# Altium schematic sheet PIC32MX.SchDoc
size A1
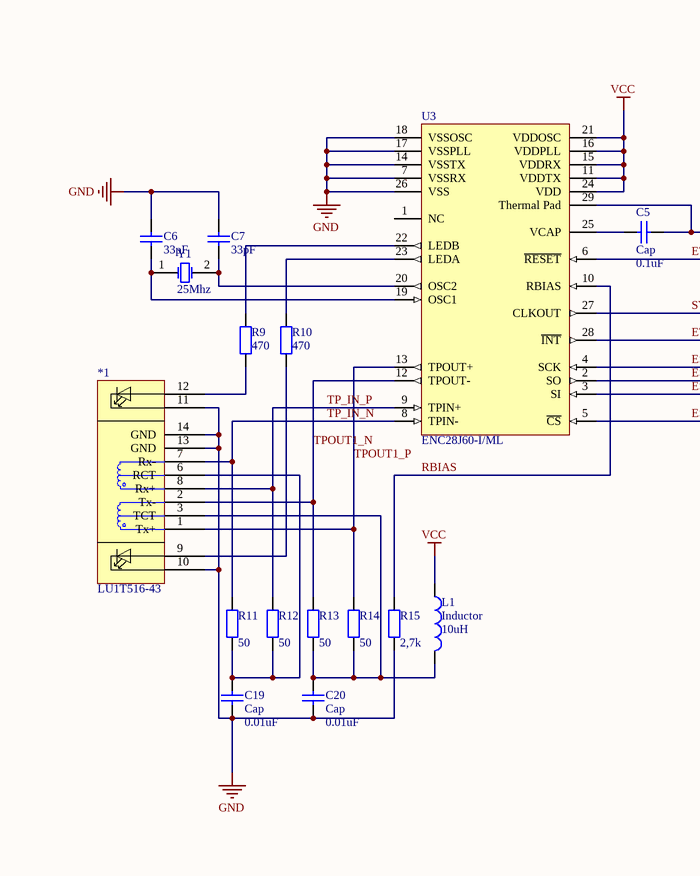
[diagram p0: PIC32MX.SchDoc, top left]
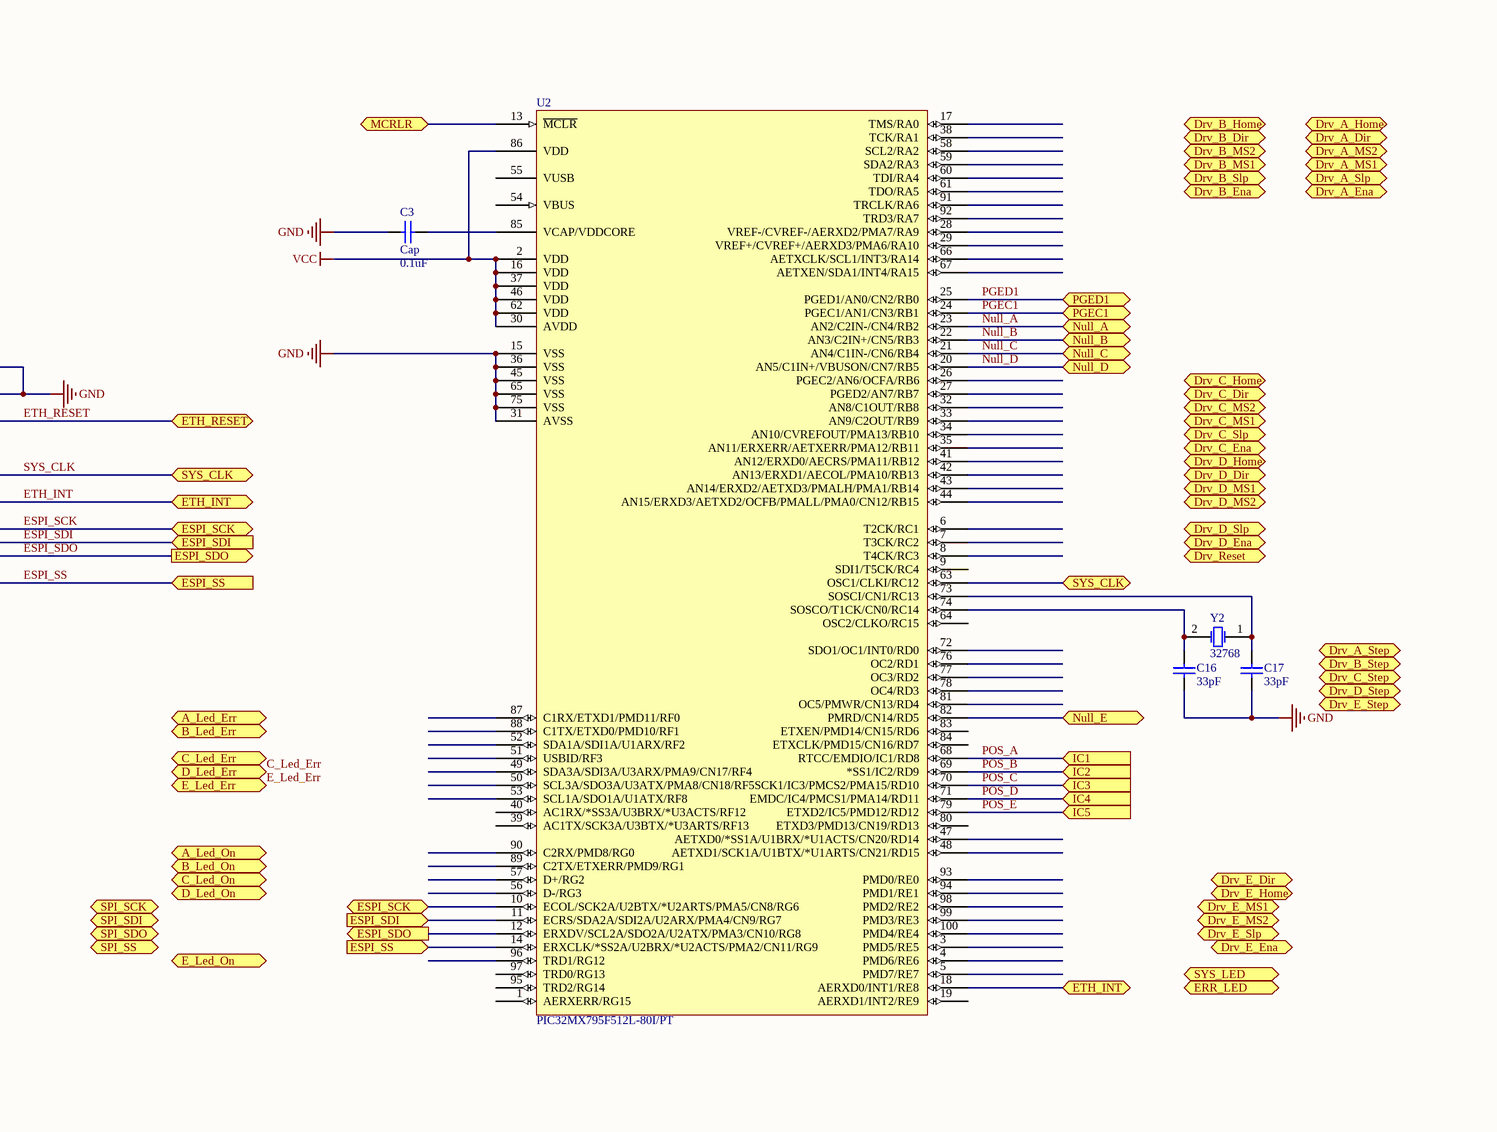
[diagram p1: PIC32MX.SchDoc, top middle]
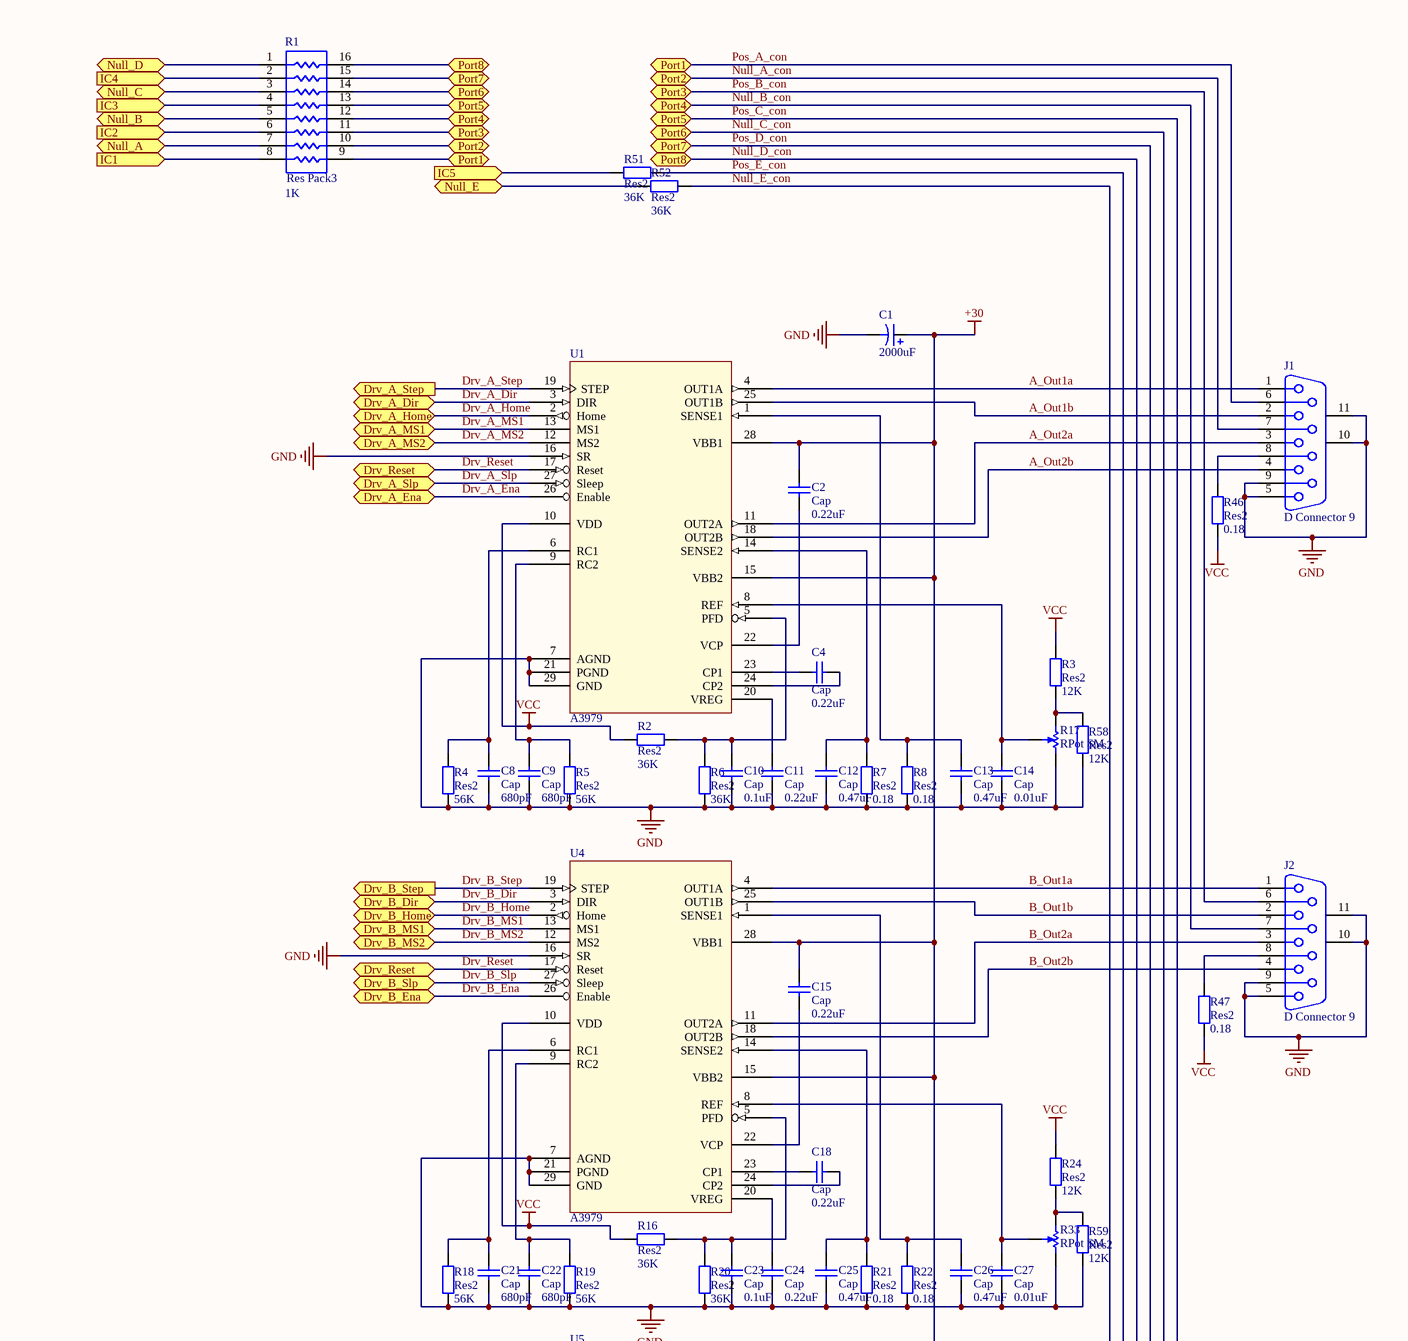
[diagram p2: PIC32MX.SchDoc, top right]
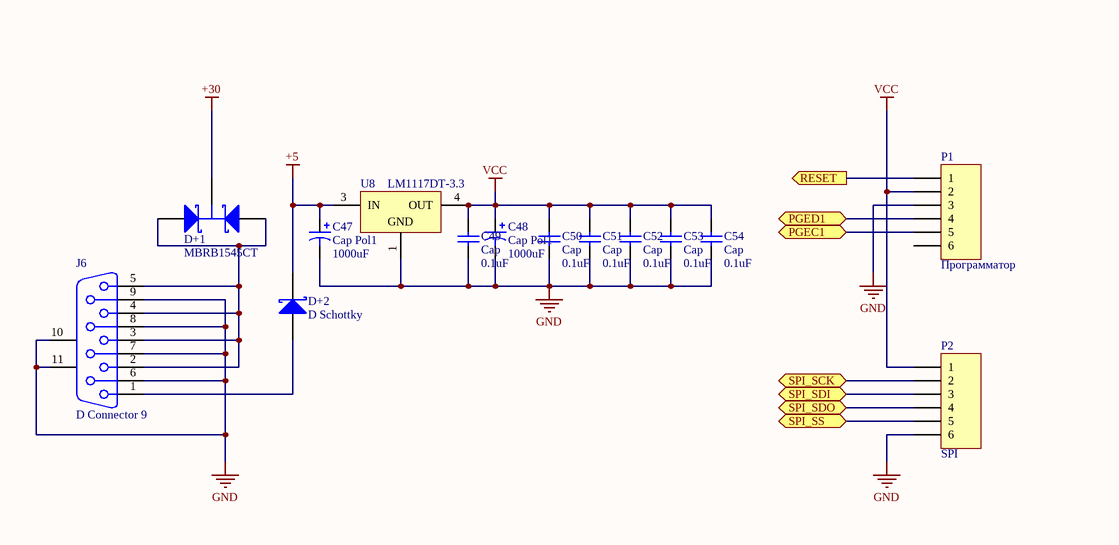
[diagram p3: PIC32MX.SchDoc, bottom left]
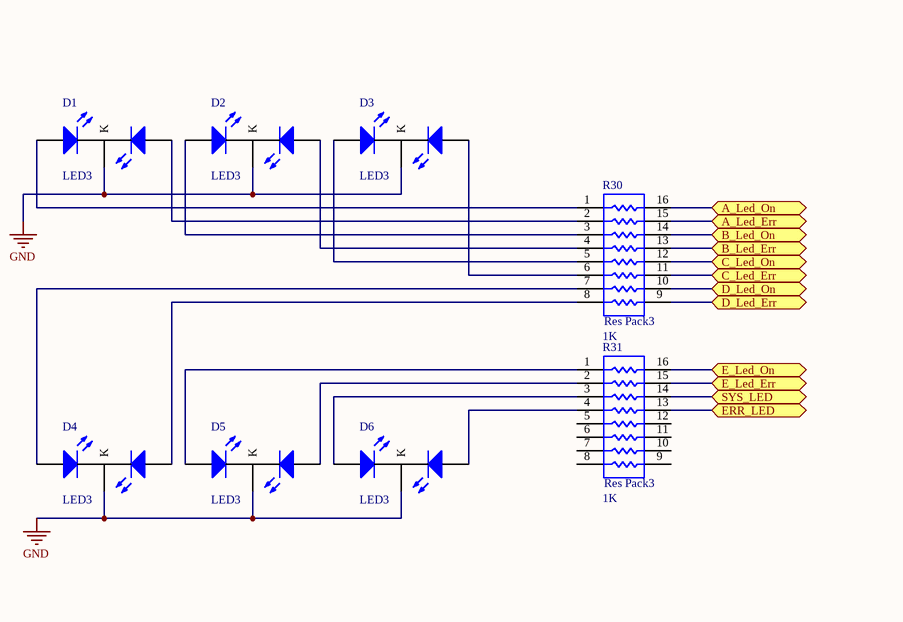
[diagram p4: PIC32MX.SchDoc, bottom middle]
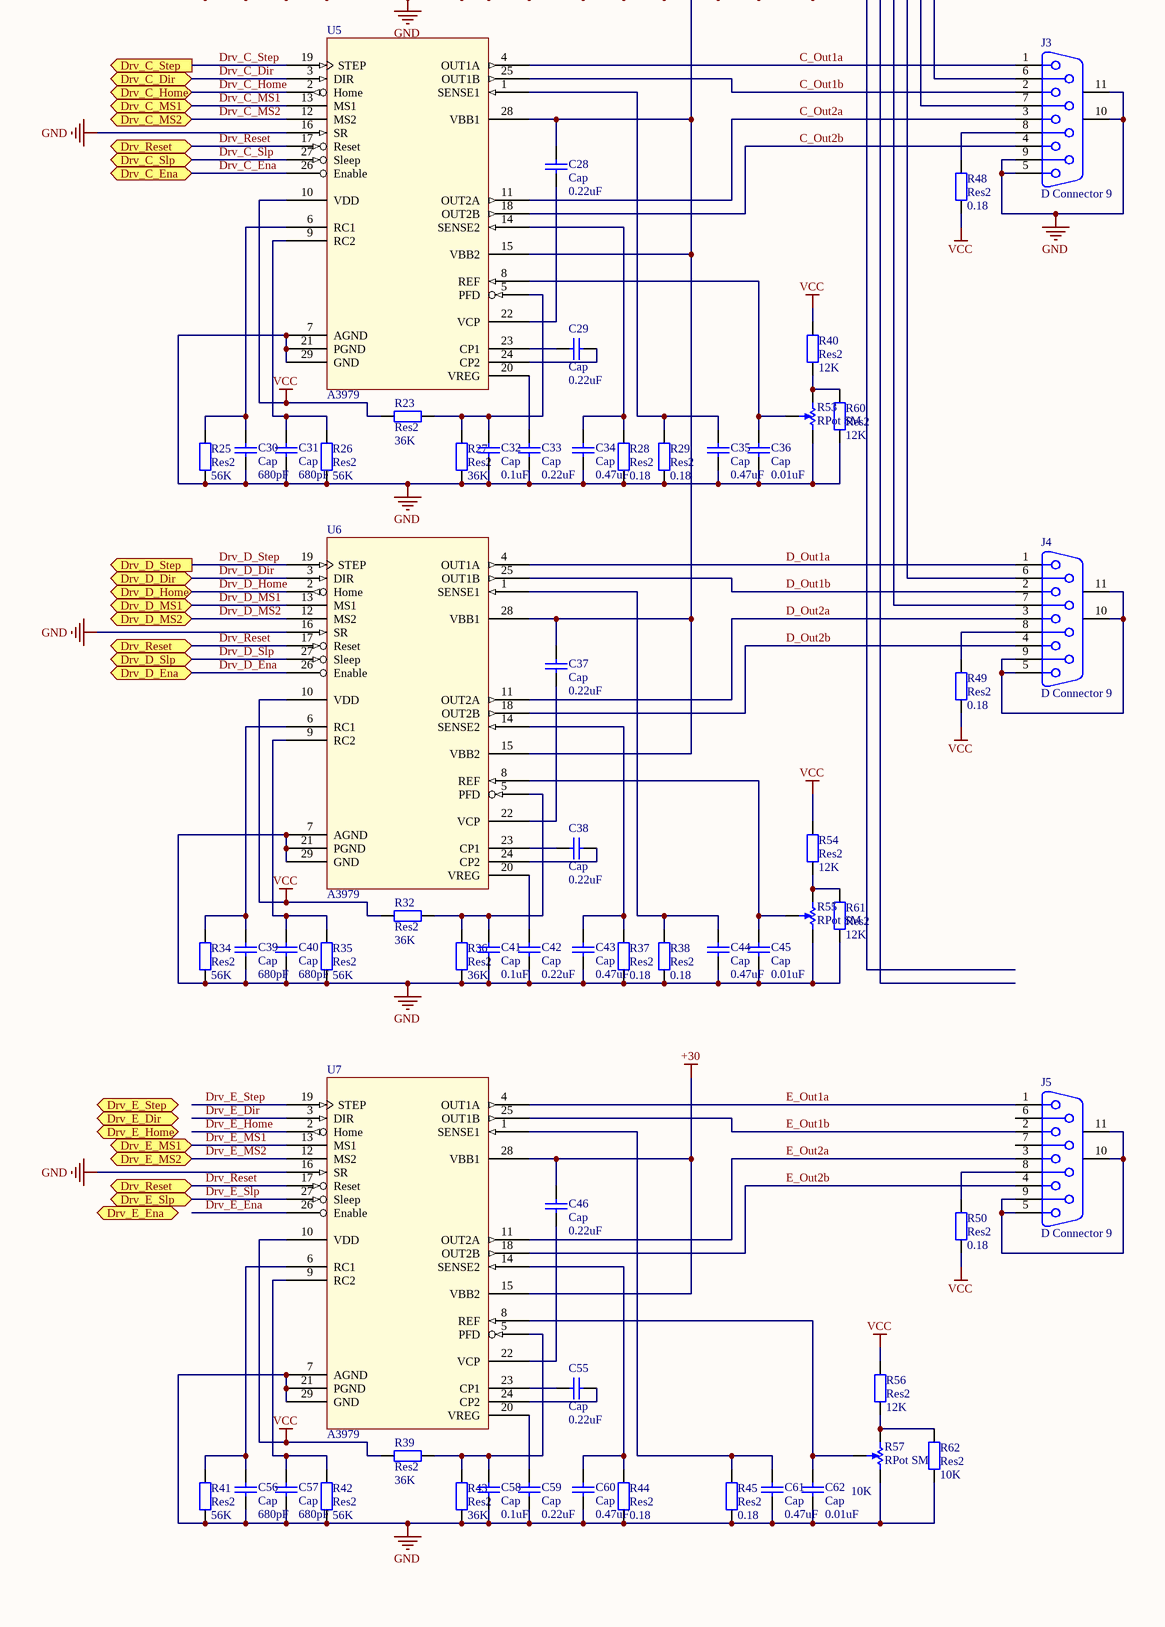
[diagram p5: PIC32MX.SchDoc, bottom right]

## Parts
*1  LU1T516-43  [EthernetCON]
C1  value 2000uF  [CAPPR7.5-16x35]  (hidden comment: Cap Pol1)
C2  Cap  value 0.22uF  [CAPC3225L]
C3  Cap  value 0.1uF  [CAPC3225L]
C4  Cap  value 0.22uF  [CapC3225L]
C5  Cap  value 0.1uF  [CAPC3225L]
C6  value 33pF  [CAPC2012L]  (hidden comment: Cap)
C7  value 33pF  [CAPC2012L]  (hidden comment: Cap)
C8  Cap  value 680pF  [CAPC2012L]
C9  Cap  value 680pF  [CAPC2012L]
C10  Cap  value 0.1uF  [CAPC3225L]
C11  Cap  value 0.22uF  [CAPC3225L]
C12  Cap  value 0.47uF  [CAPC3225L]
C13  Cap  value 0.47uF  [CAPC3225L]
C14  Cap  value 0.01uF  [CAPC2012L]
C15  Cap  value 0.22uF  [CAPC3225L]
C16  value 33pF  [CAPC2012L]  (hidden comment: Cap)
C17  value 33pF  [CAPC2012L]  (hidden comment: Cap)
C18  Cap  value 0.22uF  [CapC3225L]
C19  Cap  value 0.01uF  [CAPC3225L]
C20  Cap  value 0.01uF  [CAPC3225L]
C21  Cap  value 680pF  [CAPC2012L]
C22  Cap  value 680pF  [CAPC2012L]
C23  Cap  value 0.1uF  [CAPC3225L]
C24  Cap  value 0.22uF  [CAPC3225L]
C25  Cap  value 0.47uF  [CAPC3225L]
C26  Cap  value 0.47uF  [CAPC3225L]
C27  Cap  value 0.01uF  [CAPC2012L]
C28  Cap  value 0.22uF  [CAPC3225L]
C29  Cap  value 0.22uF  [CapC3225L]
C30  Cap  value 680pF  [CAPC2012L]
C31  Cap  value 680pF  [CAPC2012L]
C32  Cap  value 0.1uF  [CAPC3225L]
C33  Cap  value 0.22uF  [CAPC3225L]
C34  Cap  value 0.47uF  [CAPC3225L]
C35  Cap  value 0.47uF  [CAPC3225L]
C36  Cap  value 0.01uF  [CAPC2012L]
C37  Cap  value 0.22uF  [CAPC3225L]
C38  Cap  value 0.22uF  [CapC3225L]
C39  Cap  value 680pF  [CAPC2012L]
C40  Cap  value 680pF  [CAPC2012L]
C41  Cap  value 0.1uF  [CAPC3225L]
C42  Cap  value 0.22uF  [CAPC3225L]
C43  Cap  value 0.47uF  [CAPC3225L]
C44  Cap  value 0.47uF  [CAPC3225L]
C45  Cap  value 0.01uF  [CAPC2012L]
C46  Cap  value 0.22uF  [CAPC3225L]
C47  Cap Pol1  value 1000uF  [CAPPR5-5x5]
C48  Cap Pol1  value 1000uF  [CAPPR5-5x5]
C49  Cap  value 0.1uF  [CAPC3225L]
C50  Cap  value 0.1uF  [CAPC3225L]
C51  Cap  value 0.1uF  [CAPC3225L]
C52  Cap  value 0.1uF  [CAPC3225L]
C53  Cap  value 0.1uF  [CAPC3225L]
C54  Cap  value 0.1uF  [CAPC3225L]
C55  Cap  value 0.22uF  [CapC3225L]
C56  Cap  value 680pF  [CAPC2012L]
C57  Cap  value 680pF  [CAPC2012L]
C58  Cap  value 0.1uF  [CAPC3225L]
C59  Cap  value 0.22uF  [CAPC3225L]
C60  Cap  value 0.47uF  [CAPC3225L]
C61  Cap  value 0.47uF  [CAPC3225L]
C62  Cap  value 0.01uF  [CAPC2012L]
D1  LED3  [LED-2-3]
D2  LED3  [LED-2-3]
D3  LED3  [LED-2-3]
D4  LED3  [LED-2-3]
D5  LED3  [LED-2-3]
D6  LED3  [LED-2-3]
D+1  MBRB1545CT  [D2PAK]
D+2  D Schottky  [SOD-323]
J1  D Connector 9  [D-SUB-9]
J2  D Connector 9  [D-SUB-9]
J3  D Connector 9  [D-SUB-9]
J4  D Connector 9  [D-SUB-9]
J5  D Connector 9  [D-SUB-9]
J6  D Connector 9  [D-SUB-9]
L1  Inductor  value 10uH  [INDC3216AL]
P1  Программатор  [HDR1X6]
P2  SPI  [HDR1X6]
R1  Res Pack3  value 1K  [SOIC127P600-16N]
R2  Res2  value 36K  [RESC2012M]
R3  Res2  value 12K  [RESC2012M]
R4  Res2  value 56K  [RESC2012M]
R5  Res2  value 56K  [RESC2012M]
R6  Res2  value 36K  [RESC2012M]
R7  Res2  value 0.18  [RESC6332L]
R8  Res2  value 0.18  [RESC6332L]
R9  value 470  [RESC2012M]  (hidden comment: Res2)
R10  value 470  [RESC2012M]  (hidden comment: Res2)
R11  value 50  [RESC2012M]  (hidden comment: Res2)
R12  value 50  [RESC2012M]  (hidden comment: Res2)
R13  value 50  [RESC2012M]  (hidden comment: Res2)
R14  value 50  [RESC2012M]  (hidden comment: Res2)
R15  value 2,7k  [RESC2012M]  (hidden comment: Res2)
R16  Res2  value 36K  [RESC2012M]
R17  RPot SM  [3314J-1]
R18  Res2  value 56K  [RESC2012M]
R19  Res2  value 56K  [RESC2012M]
R20  Res2  value 36K  [RESC2012M]
R21  Res2  value 0.18  [RESC6332L]
R22  Res2  value 0.18  [RESC6332L]
R23  Res2  value 36K  [RESC2012M]
R24  Res2  value 12K  [RESC2012M]
R25  Res2  value 56K  [RESC2012M]
R26  Res2  value 56K  [RESC2012M]
R27  Res2  value 36K  [RESC2012M]
R28  Res2  value 0.18  [RESC6332L]
R29  Res2  value 0.18  [RESC6332L]
R30  Res Pack3  value 1K  [SOIC127P600-16N]
R31  Res Pack3  value 1K  [SOIC127P600-16N]
R32  Res2  value 36K  [RESC2012M]
R33  RPot SM  [3314J-1]
R34  Res2  value 56K  [RESC2012M]
R35  Res2  value 56K  [RESC2012M]
R36  Res2  value 36K  [RESC2012M]
R37  Res2  value 0.18  [RESC6332L]
R38  Res2  value 0.18  [RESC6332L]
R39  Res2  value 36K  [RESC2012M]
R40  Res2  value 12K  [RESC2012M]
R41  Res2  value 56K  [RESC2012M]
R42  Res2  value 56K  [RESC2012M]
R43  Res2  value 36K  [RESC2012M]
R44  Res2  value 0.18  [RESC6332L]
R45  Res2  value 0.18  [RESC6332L]
R46  Res2  value 0.18  [RESC2012M]
R47  Res2  value 0.18  [RESC2012M]
R48  Res2  value 0.18  [RESC2012M]
R49  Res2  value 0.18  [RESC2012M]
R50  Res2  value 0.18  [RESC2012M]
R51  Res2  value 36K  [RESC2012M]
R52  Res2  value 36K  [RESC2012M]
R53  RPot SM  [3314J-1]
R54  Res2  value 12K  [RESC2012M]
R55  RPot SM  [3314J-1]
R56  Res2  value 12K  [RESC2012M]
R57  RPot SM  value 10K  [3314J-1]
R58  Res2  value 12K  [RESC2012M]
R59  Res2  value 12K  [RESC2012M]
R60  Res2  value 12K  [RESC2012M]
R61  Res2  value 12K  [RESC2012M]
R62  Res2  value 10K  [RESC2012M]
U1  A3979  [TSOP65P640_HS-28AM]
U2  PIC32MX795F512L-80I/PT  [TQFP-PT100_N]
U3  ENC28J60-I/ML  [QFN-ML28_N]
U4  A3979  [TSOP65P640_HS-28AM]
U5  A3979  [TSOP65P640_HS-28AM]
U6  A3979  [TSOP65P640_HS-28AM]
U7  A3979  [TSOP65P640_HS-28AM]
U8  LM1117DT-3.3  [TD03B_N]
Y1  value 25Mhz  [Quartz]  (hidden comment: XTAL)
Y2  value 32768  [Quartz]  (hidden comment: XTAL)

## Ports
A_Led_Err, A_Led_On, B_Led_Err, B_Led_On, C_Led_Err, C_Led_On, D_Led_Err, D_Led_On, Drv_A_Dir, Drv_A_Ena, Drv_A_Home, Drv_A_MS1, Drv_A_MS2, Drv_A_Slp, Drv_A_Step (out), Drv_B_Dir, Drv_B_Ena, Drv_B_Home, Drv_B_MS1, Drv_B_MS2, Drv_B_Slp, Drv_B_Step (out), Drv_C_Dir, Drv_C_Ena, Drv_C_Home, Drv_C_MS1, Drv_C_MS2, Drv_C_Slp, Drv_C_Step (out), Drv_D_Dir, Drv_D_Ena, Drv_D_Home, Drv_D_MS1, Drv_D_MS2, Drv_D_Slp, Drv_D_Step (out), Drv_E_Dir, Drv_E_Ena, Drv_E_Home, Drv_E_MS1, Drv_E_MS2, Drv_E_Slp, Drv_E_Step (out), Drv_Reset, E_Led_Err, E_Led_On, ERR_LED, ESPI_SCK (bidir), ESPI_SDI (in), ESPI_SDO (out), ESPI_SS (in), ETH_INT, ETH_RESET, IC1 (in), IC2 (in), IC3 (in), IC4 (in), IC5 (in), MCRLR, Null_A, Null_B, Null_C, Null_D, Null_E, PGEC1, PGED1, Port1, Port2, Port3, Port4, Port5, Port6, Port7, Port8, RESET (out), SPI_SCK (bidir), SPI_SDI (bidir), SPI_SDO (bidir), SPI_SS (bidir), SYS_CLK, SYS_LED

## Nets
+5: C47.1 D+2.2(K) U8.3(IN)
+30: C1.1 C2.2 C15.2 C28.2 C37.2 C46.2 D+1.2(K) U1.15(VBB2) U1.28(VBB1) U4.15(VBB2) U4.28(VBB1) U5.15(VBB2) U5.28(VBB1) U6.15(VBB2) U6.28(VBB1) U7.15(VBB2) U7.28(VBB1)
GND: *1.10 *1.11 *1.13(GND) *1.14(GND) C1.2 C3.1 C5.2 C6.2 C7.1 C8.1 C9.1 C10.1 C11.1 C12.1 C13.1 C14.1 C16.1 C17.2 C19.1 C20.1 C21.1 C22.1 C23.1 C24.1 C25.1 C26.1 C27.1 C30.1 C31.1 C32.1 C33.1 C34.1 C35.1 C36.1 C39.1 C40.1 C41.1 C42.1 C43.1 C44.1 C45.1 C47.2 C48.2 C49.2 C50.2 C51.2 C52.2 C53.2 C54.2 C56.1 C57.1 C58.1 C59.1 C60.1 C61.1 C62.1 D1.2(K) D2.2(K) D3.2(K) D4.2(K) D5.2(K) D6.2(K) J1.5 J1.9 J1.10(MH1) J1.11(MH2) J2.5 J2.9 J2.10(MH1) J2.11(MH2) J3.5 J3.9 J3.10(MH1) J3.11(MH2) J6.6 J6.7 J6.8 J6.9 J6.10(MH1) J6.11(MH2) P1.3 P2.6 R4.1 R5.1 R6.1 R7.1 R8.1 R15.1 R17.CW(+) R18.1 R19.1 R20.1 R21.1 R22.1 R25.1 R26.1 R27.1 R28.1 R29.1 R33.CW(+) R34.1 R35.1 R36.1 R37.1 R38.1 R41.1 R42.1 R43.1 R44.1 R45.1 R53.CW(+) R55.CW(+) R57.CW(+) R58.1 R59.1 R60.1 R61.1 R62.1 U1.7(AGND) U1.16(SR) U1.21(PGND) U1.29(GND) U2.15(VSS) U2.31(AVSS) U2.36(VSS) U2.45(VSS) U2.65(VSS) U2.75(VSS) U3.7(VSSRX) U3.14(VSSTX) U3.17(VSSPLL) U3.18(VSSOSC) U3.26(VSS) U3.29(Thermal_Pad) U4.7(AGND) U4.16(SR) U4.21(PGND) U4.29(GND) U5.7(AGND) U5.16(SR) U5.21(PGND) U5.29(GND) U6.7(AGND) U6.16(SR) U6.21(PGND) U6.29(GND) U7.7(AGND) U7.16(SR) U7.21(PGND) U7.29(GND) U8.1(GND)
VCC: C48.1 C49.1 C50.1 C51.1 C52.1 C53.1 C54.1 L1.1 P1.2 P2.1 R2.2 R3.2 R16.2 R23.2 R24.2 R32.2 R39.2 R40.2 R46.1 R47.1 R48.1 R49.1 R50.1 R54.2 R56.2 U1.10(VDD) U2.2(VDD) U2.16(VDD) U2.30(AVDD) U2.37(VDD) U2.46(VDD) U2.62(VDD) U2.86(VDD) U3.11(VDDTX) U3.15(VDDRX) U3.16(VDDPLL) U3.21(VDDOSC) U3.24(VDD) U4.10(VDD) U5.10(VDD) U6.10(VDD) U7.10(VDD) U8.4(OUT)
A_Led_Err: R30.15 ; port A_Led_Err
A_Led_On: R30.16 ; port A_Led_On
A_Out1a: J1.1 U1.4(OUT1A)
A_Out1b: J1.2 U1.25(OUT1B)
A_Out2a: J1.3 U1.11(OUT2A)
A_Out2b: J1.4 U1.18(OUT2B)
B_Led_Err: R30.13 ; port B_Led_Err
B_Led_On: R30.14 ; port B_Led_On
B_Out1a: J2.1 U4.4(OUT1A)
B_Out1b: J2.2 U4.25(OUT1B)
B_Out2a: J2.3 U4.11(OUT2A)
B_Out2b: J2.4 U4.18(OUT2B)
C_Led_Err: R30.11 ; port C_Led_Err
C_Led_Err: R30.9 ; port D_Led_Err  [a separate net that carries the same name]
C_Led_On: R30.12 ; port C_Led_On
C_Out1a: J3.1 U5.4(OUT1A)
C_Out1b: J3.2 U5.25(OUT1B)
C_Out2a: J3.3 U5.11(OUT2A)
C_Out2b: J3.4 U5.18(OUT2B)
D_Led_On: R30.10 ; port D_Led_On
D_Out1a: J4.1 U6.4(OUT1A)
D_Out1b: J4.2 U6.25(OUT1B)
D_Out2a: J4.3 U6.11(OUT2A)
D_Out2b: J4.4 U6.18(OUT2B)
Drv_A_Dir: U1.3(DIR) ; port Drv_A_Dir
Drv_A_Ena: U1.26(Enable) ; port Drv_A_Ena
Drv_A_Home: U1.2(Home) ; port Drv_A_Home
Drv_A_MS1: U1.13(MS1) ; port Drv_A_MS1
Drv_A_MS2: U1.12(MS2) ; port Drv_A_MS2
Drv_A_Slp: U1.27(Sleep) ; port Drv_A_Slp
Drv_A_Step: U1.19(STEP) ; port Drv_A_Step
Drv_B_Dir: U4.3(DIR) ; port Drv_B_Dir
Drv_B_Ena: U4.26(Enable) ; port Drv_B_Ena
Drv_B_Home: U4.2(Home) ; port Drv_B_Home
Drv_B_MS1: U4.13(MS1) ; port Drv_B_MS1
Drv_B_MS2: U4.12(MS2) ; port Drv_B_MS2
Drv_B_Slp: U4.27(Sleep) ; port Drv_B_Slp
Drv_B_Step: U4.19(STEP) ; port Drv_B_Step
Drv_C_Dir: U5.3(DIR) ; port Drv_C_Dir
Drv_C_Ena: U5.26(Enable) ; port Drv_C_Ena
Drv_C_Home: U5.2(Home) ; port Drv_C_Home
Drv_C_MS1: U5.13(MS1) ; port Drv_C_MS1
Drv_C_MS2: U5.12(MS2) ; port Drv_C_MS2
Drv_C_Slp: U5.27(Sleep) ; port Drv_C_Slp
Drv_C_Step: U5.19(STEP) ; port Drv_C_Step
Drv_D_Dir: U6.3(DIR) ; port Drv_D_Dir
Drv_D_Ena: U6.26(Enable) ; port Drv_D_Ena
Drv_D_Home: U6.2(Home) ; port Drv_D_Home
Drv_D_MS1: U6.13(MS1) ; port Drv_D_MS1
Drv_D_MS2: U6.12(MS2) ; port Drv_D_MS2
Drv_D_Slp: U6.27(Sleep) ; port Drv_D_Slp
Drv_D_Step: U6.19(STEP) ; port Drv_D_Step
Drv_E_Dir: U7.3(DIR)
Drv_E_Ena: U7.26(Enable)
Drv_E_Home: U7.2(Home)
Drv_E_MS1: U7.13(MS1) ; port Drv_E_MS1
Drv_E_MS2: U7.12(MS2) ; port Drv_E_MS2
Drv_E_Slp: U7.27(Sleep) ; port Drv_E_Slp
Drv_E_Step: U7.19(STEP)
Drv_Reset: U1.17(Reset) U4.17(Reset) U5.17(Reset) U6.17(Reset) U7.17(Reset) ; port Drv_Reset
E_Led_Err: R31.15 ; port E_Led_Err
E_Led_On: R31.16 ; port E_Led_On
E_Out1a: J5.1 U7.4(OUT1A)
E_Out1b: J5.2 U7.25(OUT1B)
E_Out2a: J5.3 U7.11(OUT2A)
E_Out2b: J5.4 U7.18(OUT2B)
ERR_LED: R31.13 ; port ERR_LED
ESPI_SCK: U2.10(ECOL/SCK2A/U2BTX/*U2ARTS/PMA5/CN8/RG6) U3.4(SCK) ; port ESPI_SCK
ESPI_SDI: U2.11(ECRS/SDA2A/SDI2A/U2ARX/PMA4/CN9/RG7) U3.2(SO) ; port ESPI_SDI
ESPI_SDO: U2.12(ERXDV/SCL2A/SDO2A/U2ATX/PMA3/CN10/RG8) U3.3(SI) ; port ESPI_SDO
ESPI_SS: U2.14(ERXCLK/*SS2A/U2BRX/*U2ACTS/PMA2/CN11/RG9) U3.5(~{CS}) ; port ESPI_SS
ETH_INT: U2.18(AERXD0/INT1/RE8) U3.28(~{INT}) ; port ETH_INT
ETH_RESET: U3.6(~{RESET}) ; port ETH_RESET
MCRLR: U2.13(~{MCLR}) ; port MCRLR
Null_A: R1.7 U2.23(AN2/C2IN-/CN4/RB2) ; port Null_A
Null_A_con: J1.7 R1.10 ; port Port2
Null_B: R1.5 U2.22(AN3/C2IN+/CN5/RB3) ; port Null_B
Null_B_con: J2.7 R1.12 ; port Port4
Null_C: R1.3 U2.21(AN4/C1IN-/CN6/RB4) ; port Null_C
Null_C_con: J3.7 R1.14 ; port Port6
Null_D: R1.1 U2.20(AN5/C1IN+/VBUSON/CN7/RB5) ; port Null_D
Null_D_con: J4.7 R1.16 ; port Port8
Null_E: R52.2 U2.82(PMRD/CN14/RD5) ; port Null_E
Null_E_con: R52.1
PGEC1: P1.5 U2.24(PGEC1/AN1/CN3/RB1) ; port PGEC1
PGED1: P1.4 U2.25(PGED1/AN0/CN2/RB0) ; port PGED1
POS_A: R1.8 U2.68(RTCC/EMDIO/IC1/RD8) ; port IC1
Pos_A_con: J1.6 R1.9 ; port Port1
POS_B: R1.6 U2.69(*SS1/IC2/RD9) ; port IC2
Pos_B_con: J2.6 R1.11 ; port Port3
POS_C: R1.4 U2.70(SCK1/IC3/PMCS2/PMA15/RD10) ; port IC3
Pos_C_con: J3.6 R1.13 ; port Port5
POS_D: R1.2 U2.71(EMDC/IC4/PMCS1/PMA14/RD11) ; port IC4
Pos_D_con: J4.6 R1.15 ; port Port7
POS_E: R51.2 U2.79(ETXD2/IC5/PMD12/RD12) ; port IC5
Pos_E_con: R51.1
RBIAS: R15.2 U3.10(RBIAS)
RESET: P1.1 ; port RESET
SPI_SCK: P2.2 ; port SPI_SCK
SPI_SDI: P2.3 ; port SPI_SDI
SPI_SDO: P2.4 ; port SPI_SDO
SPI_SS: P2.5 ; port SPI_SS
SYS_CLK: U2.63(OSC1/CLKI/RC12) U3.27(CLKOUT) ; port SYS_CLK
SYS_LED: R31.14 ; port SYS_LED
TP_IN_N: *1.7(Rx-) R11.2 U3.8(TPIN-)
TP_IN_P: *1.8(Rx+) R12.2 U3.9(TPIN+)
TPOUT1_N: *1.2(Tx-) R13.2 U3.12(TPOUT-)
TPOUT1_P: *1.1(Tx+) R14.2 U3.13(TPOUT+)
Net*1_3: *1.3(TCT) C20.2 L1.2 R13.1 R14.1
Net*1_6: *1.6(RCT) C19.2 R11.1 R12.1
Net*1_9: *1.9 R10.2
Net*1_12: *1.12 R9.2
NetC2_1: C2.1 U1.22(VCP)
NetC3_2: C3.2 U2.85(VCAP/VDDCORE)
NetC4_1: C4.1 U1.24(CP2)
NetC4_2: C4.2 U1.23(CP1)
NetC5_1: C5.1 U3.25(VCAP)
NetC6_1: C6.1 U3.19(OSC1) Y1.1(OSC1)
NetC7_2: C7.2 U3.20(OSC2) Y1.2(OSC2)
NetC8_2: C8.2 R4.2 U1.6(RC1)
NetC9_2: C9.2 R5.2 U1.9(RC2)
NetC10_2: C10.2 R2.1 R6.2 U1.5(PFD)
NetC11_2: C11.2 U1.20(VREG)
NetC12_2: C12.2 R7.2 U1.14(SENSE2)
NetC13_2: C13.2 R8.2 U1.1(SENSE1)
NetC14_2: C14.2 R17.W U1.8(REF)
NetC15_1: C15.1 U4.22(VCP)
NetC16_2: C16.2 U2.74(SOSCO/T1CK/CN0/RC14) Y2.2(OSC2)
NetC17_1: C17.1 U2.73(SOSCI/CN1/RC13) Y2.1(OSC1)
NetC18_1: C18.1 U4.24(CP2)
NetC18_2: C18.2 U4.23(CP1)
NetC21_2: C21.2 R18.2 U4.6(RC1)
NetC22_2: C22.2 R19.2 U4.9(RC2)
NetC23_2: C23.2 R16.1 R20.2 U4.5(PFD)
NetC24_2: C24.2 U4.20(VREG)
NetC25_2: C25.2 R21.2 U4.14(SENSE2)
NetC26_2: C26.2 R22.2 U4.1(SENSE1)
NetC27_2: C27.2 R33.W U4.8(REF)
NetC28_1: C28.1 U5.22(VCP)
NetC29_1: C29.1 U5.24(CP2)
NetC29_2: C29.2 U5.23(CP1)
NetC30_2: C30.2 R25.2 U5.6(RC1)
NetC31_2: C31.2 R26.2 U5.9(RC2)
NetC32_2: C32.2 R23.1 R27.2 U5.5(PFD)
NetC33_2: C33.2 U5.20(VREG)
NetC34_2: C34.2 R28.2 U5.14(SENSE2)
NetC35_2: C35.2 R29.2 U5.1(SENSE1)
NetC36_2: C36.2 R53.W U5.8(REF)
NetC37_1: C37.1 U6.22(VCP)
NetC38_1: C38.1 U6.24(CP2)
NetC38_2: C38.2 U6.23(CP1)
NetC39_2: C39.2 R34.2 U6.6(RC1)
NetC40_2: C40.2 R35.2 U6.9(RC2)
NetC41_2: C41.2 R32.1 R36.2 U6.5(PFD)
NetC42_2: C42.2 U6.20(VREG)
NetC43_2: C43.2 R37.2 U6.14(SENSE2)
NetC44_2: C44.2 R38.2 U6.1(SENSE1)
NetC45_2: C45.2 R55.W U6.8(REF)
NetC46_1: C46.1 U7.22(VCP)
NetC55_1: C55.1 U7.24(CP2)
NetC55_2: C55.2 U7.23(CP1)
NetC56_2: C56.2 R41.2 U7.6(RC1)
NetC57_2: C57.2 R42.2 U7.9(RC2)
NetC58_2: C58.2 R39.1 R43.2 U7.5(PFD)
NetC59_2: C59.2 U7.20(VREG)
NetC60_2: C60.2 R44.2 U7.14(SENSE2)
NetC61_2: C61.2 R45.2 U7.1(SENSE1)
NetC62_2: C62.2 R57.W U7.8(REF)
NetD1_1: D1.1(A) R30.1
NetD1_3: D1.3(A) R30.2
NetD2_1: D2.1(A) R30.3
NetD2_3: D2.3(A) R30.4
NetD3_1: D3.1(A) R30.5
NetD3_3: D3.3(A) R30.6
NetD4_1: D4.1(A) R30.7
NetD4_3: D4.3(A) R30.8
NetD5_1: D5.1(A) R31.1
NetD5_3: D5.3(A) R31.2
NetD6_1: D6.1(A) R31.3
NetD6_3: D6.3(A) R31.4
NetD+1_1: D+1.1(A1) D+1.3(A2) J6.2 J6.3 J6.4 J6.5
NetD+2_1: D+2.1(A) J6.1
NetJ1_8: J1.8 R46.2
NetJ2_8: J2.8 R47.2
NetJ3_8: J3.8 R48.2
NetJ4_5: J4.5 J4.9 J4.10(MH1) J4.11(MH2)
NetJ4_8: J4.8 R49.2
NetJ5_5: J5.5 J5.9 J5.10(MH1) J5.11(MH2)
NetJ5_8: J5.8 R50.2
NetR3_1: R3.1 R17.CCW(-) R58.2
NetR9_1: R9.1 U3.22(LEDB)
NetR10_1: R10.1 U3.23(LEDA)
NetR24_1: R24.1 R33.CCW(-) R59.2
NetR40_1: R40.1 R53.CCW(-) R60.2
NetR54_1: R54.1 R55.CCW(-) R61.2
NetR56_1: R56.1 R57.CCW(-) R62.2

Not connected (* = marked no-connect by the designer): J5 6 7; P1 6; R31 5 6 7 8 9 10 11 12; U2 1(AERXERR/RG15) 3(PMD5/RE5) 4(PMD6/RE6) 5(PMD7/RE7) 6(T2CK/RC1) 7(T3CK/RC2) 8(T4CK/RC3) 9(SDI1/T5CK/RC4) 17(TMS/RA0) 19(AERXD1/INT2/RE9) 26(PGEC2/AN6/OCFA/RB6) 27(PGED2/AN7/RB7) 28(VREF-/CVREF-/AERXD2/PMA7/RA9) 29(VREF+/CVREF+/AERXD3/PMA6/RA10) 32(AN8/C1OUT/RB8) 33(AN9/C2OUT/RB9) 34(AN10/CVREFOUT/PMA13/RB10) 35(AN11/ERXERR/AETXERR/PMA12/RB11) 38(TCK/RA1) 39(AC1TX/SCK3A/U3BTX/*U3ARTS/RF13) 40(AC1RX/*SS3A/U3BRX/*U3ACTS/RF12) 41(AN12/ERXD0/AECRS/PMA11/RB12) 42(AN13/ERXD1/AECOL/PMA10/RB13) 43(AN14/ERXD2/AETXD3/PMALH/PMA1/RB14) 44(AN15/ERXD3/AETXD2/OCFB/PMALL/PMA0/CN12/RB15) 47(AETXD0/*SS1A/U1BRX/*U1ACTS/CN20/RD14) 48(AETXD1/SCK1A/U1BTX/*U1ARTS/CN21/RD15) 49(SDA3A/SDI3A/U3ARX/PMA9/CN17/RF4) 50(SCL3A/SDO3A/U3ATX/PMA8/CN18/RF5) 51(USBID/RF3) 52(SDA1A/SDI1A/U1ARX/RF2) 53(SCL1A/SDO1A/U1ATX/RF8) 54(VBUS) 55(VUSB) 56(D-/RG3) 57(D+/RG2) 58(SCL2/RA2) 59(SDA2/RA3) 60(TDI/RA4) 61(TDO/RA5) 64(OSC2/CLKO/RC15) 66(AETXCLK/SCL1/INT3/RA14) 67(AETXEN/SDA1/INT4/RA15) 72(SDO1/OC1/INT0/RD0) 76(OC2/RD1) 77(OC3/RD2) 78(OC4/RD3) 80(ETXD3/PMD13/CN19/RD13) 81(OC5/PMWR/CN13/RD4) 83(ETXEN/PMD14/CN15/RD6) 84(ETXCLK/PMD15/CN16/RD7) 87(C1RX/ETXD1/PMD11/RF0) 88(C1TX/ETXD0/PMD10/RF1) 89(C2TX/ETXERR/PMD9/RG1) 90(C2RX/PMD8/RG0) 91(TRCLK/RA6) 92(TRD3/RA7) 93(PMD0/RE0) 94(PMD1/RE1) 95(TRD2/RG14) 96(TRD1/RG12) 97(TRD0/RG13) 98(PMD2/RE2) 99(PMD3/RE3) 100(PMD4/RE4); U3 1(NC)

## Library data of the parts
C1 C47 C48 = Cap Pol1: Polarized Capacitor (Radial); Published: 8-Jun-2000; LatestRevisionDate: 17-Jul-2002; LatestRevisionNote: Re-released for DXP Platform.; PackageReference: RB7.6-15; Publisher: Altium Limited
C2-C46 C49-C62 = Cap: Capacitor; Published: 8-Jun-2000; LatestRevisionDate: 17-Jul-2002; LatestRevisionNote: Re-released for DXP Platform.; PackageReference: RAD-0.3; Publisher: Altium Limited
D1-D6 = LED3: Typical BLUE SiC LED; Published: 8-Jun-2000; LatestRevisionDate: 17-Dec-2003; LatestRevisionNote: PCB Footprint replaced.; DatasheetVersion: 16-Apr-2002; PackageVersion: 16-Apr-2002; PackageReference: 3.5X2.8X1.9; Publisher: Altium Limited
D+1 = MBRB1545CT: Schottky Rectifier; Note: Terminal 2 is the TAB and is electrically connected to the cathode; Published: 8-Jun-2000; LatestRevisionDate: 17-Jul-2002; LatestRevisionNote: Re-released for DXP Platform.; DatasheetDocument: May-1998; PackageReference: D2PAK; Publisher: Altium Limited; ComponentLink1Description: Manufacturer Link; ComponentLink1URL: http://www.irf.com/; ComponentLink2Description: Datasheet; ComponentLink2URL: http://www.irf.com/product-info/datasheets/data/mbrb1535ct.pdf
D+2 = D Schottky: Schottky Diode; Published: 8-Jun-2000; LatestRevisionDate: 17-Jul-2002; LatestRevisionNote: Re-released for DXP Platform.; PackageReference: SMB; Publisher: Altium Limited; Code_JEDEC: DO-214-AA
J1-J6 = D Connector 9: Receptacle Assembly, 9 Position, Right Angle; PackageDocument: O; Positions: 9; Published: 15-Jun-2001; LatestRevisionDate: 17-Jul-2002; LatestRevisionNote: Re-released for DXP Platform.; DatasheetDocument: 1-Sep-1999; PackageReference: 788750; Publisher: Altium Limited; Orientation: Right Angle; Gender: Receptacle
L1 = Inductor: Code_IEC: 1005; Published: 8-Jun-2000; LatestRevisionDate: 29-May-2009; LatestRevisionNote: IPC-7351 Footprint Added.; PackageReference: 0402-A; Publisher: Altium Limited; PackageDescription: Chip Inductor; Code_JEITA: 0402
P1 P2 = Header 6: Header, 6-Pin; LatestRevisionDate: 17-Jul-2002; LatestRevisionNote: Re-released for DXP Platform.; Publisher: Altium Limited
R1 R30 R31 = Res Pack3: Isolated Resistor Network; Published: 24-Mar-1999; LatestRevisionDate: 29-May-2009; LatestRevisionNote: IPC-7351 Footprint Added.; PackageReference: SO-16; Publisher: Altium Limited; PackageDescription: 16-Pin Small Outline Integrated Circuit 1.27 mm Pitch; Code_JEDEC: MS-012-AC; Code_IPC: SOIC127P600-16
R2-R16 R18-R29 R32 R34-R52 R54 R56 R58-R62 = Res2: Resistor; Published: 8-Jun-2000; LatestRevisionDate: 17-Jul-2002; LatestRevisionNote: Re-released for DXP Platform.; PackageReference: AXIAL-0.4; Publisher: Altium Limited
R17 R33 R53 R55 R57 = RPot SM: Square Trimming Potentiometer; Published: 17-Dec-2003; DatasheetVersion: Oct-2003; PackageReference: POT4MM-2; Publisher: Altium Limited; ComponentLink1Description: Manufacturer Link; ComponentLink1URL: http://bourns.com/2/search.html
U1 U4-U7 = A3979: Microstepping DMOS Driver with Translator 2.5A
U2 = PIC32MX795F512L-80I/PT_1: 32-Bit Flash Microcontroller with USB, 85 IOs, 512KB Program Memory, 100-pin TQFP; Published: 29-Jan-2009; DatasheetVersion: revC, Apr-2008; PackageVersion: revAW, Oct-2008; PackageReference: TQFP-PT100; Publisher: Altium Limited; PackageDescription: 100-Lead Plastic Thin Quad Flatpack (PT) - 12x12x1mm Body, 2.00mm [TQFP]; ComponentLink1Description: Manufacturer Link; ComponentLink1URL: http://www.microchip.com; ComponentLink2Description: Datasheet; ComponentLink2URL: http://ww1.microchip.com/downloads/en/DeviceDoc/PIC32MX_Datasheet_v3_61143C.pdf; ComponentLink3Description: Packaging Specification; ComponentLink3URL: http://ww1.microchip.com/downloads/en/PackagingSpec/00049AW.pdf
U3 = ENC28J60-I/ML: Stand-Alone Ethernet Controller with SPI Interface, 28-Pin QFN, Industrial Temperature; Published: 29-Jan-2009; LatestRevisionDate: 4-May-2009; LatestRevisionNote: Pinout fixed; DatasheetVersion: RevC, Jan-2008; PackageVersion: revAW, Oct-2008; PackageReference: QFN-ML28; Publisher: Altium Limited; PackageDescription: 28-Lead Plastic Quad Flat, No Lead Package (ML) - 6x6 mm Body [QFN] with 0.55 mm Contact Length; Code_JEDEC: MO-220; Code_IPC: QFN65P600X600-28V; ComponentLink1Description: Manufacturer Link; ComponentLink1URL: http://www.microchip.com; ComponentLink2Description: Datasheet; ComponentLink2URL: http://ww1.microchip.com/downloads/en/DeviceDoc/39662c.pdf; ComponentLink3Description: Packaging Specification; ComponentLink3URL: http://ww1.microchip.com/downloads/en/PackagingSpec/00049AW.pdf
U8 = LM1117DT-3.3: 800mA Low-Dropout Linear Regulator; Manufacturer: National Semiconductor; CompType: LDO IC; PackageTopMarking: NSUZXYTT*LM1117*DT-3.3; PowerWise: N; Published: 4-Dec-2008; DatasheetVersion: Apr-2006; PackageVersion: revC, Apr-2003; PackageReference: TD03B; Publisher: Altium Limited; PackageDescription: TO252, Molded, Jedec, 6.8 x 6.10 x 2.30mm Body, 3 Lead, 2.28mm Pitch, Surface Mount; PartNumber: LM1117DT-3.3; RoHS: O; PinCount: 3; DigiKeyPartNumber: LM1117DT-3.3-ND; Code_JEDEC: TO-252-AA; ComponentLink1Description: LM1117 Datasheet; ComponentLink1URL: http://www.national.com/ds/LM/LM1117.pdf; ComponentLink2Description: LM1117 Web Page; ComponentLink2URL: http://www.national.com/pf/LM/LM1117.html; ComponentLink3Description: TD03B Package Page; ComponentLink3URL: http://www.national.com/packaging/folders/td03b.html
Y1 Y2 = XTAL: Crystal Oscillator; Published: 8-Jun-2000; LatestRevisionDate: 17-Jul-2002; LatestRevisionNote: Re-released for DXP Platform.; PackageReference: R38; Publisher: Altium Limited